# Altium schematic sheet Sheet2.SchDoc
size A; SheetNumber: 2; SheetTotal: 2
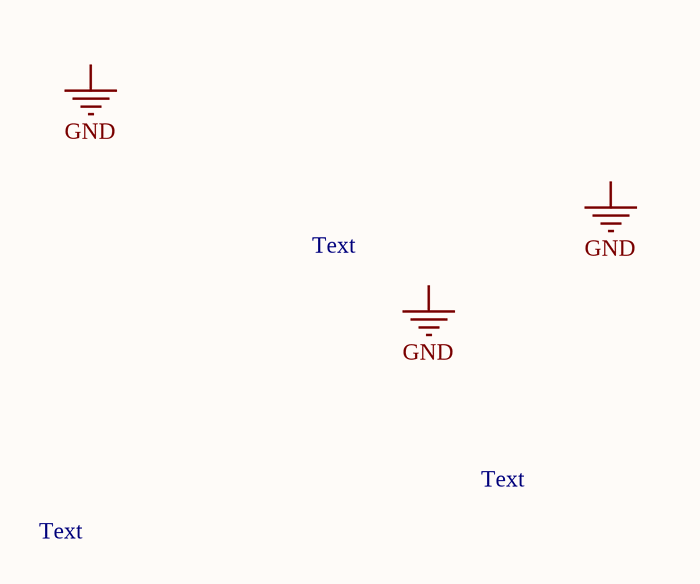
[diagram p0: Sheet2.SchDoc]

## Notes on the sheet
- Text
- Labels drawn without touching a wire or pin: GND